# Altium schematic sheet pointed-net-label-detail.SchDoc
size 101 x 76 mm
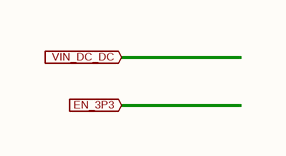
[diagram p0: pointed-net-label-detail.SchDoc]